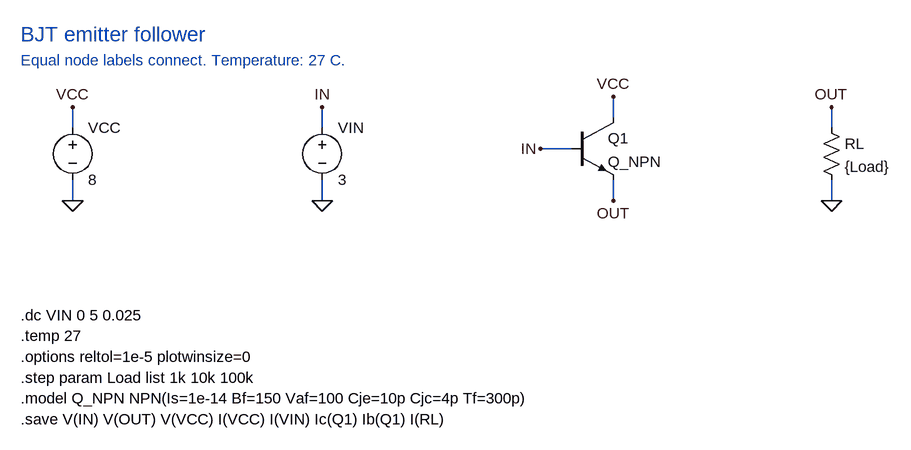
[diagram p0: schematic emitter-follower.asc]
emitter-follower.asc, the LTspice schematic file:
Version 4
SHEET 1 1740 776
WIRE 144 176 144 144
WIRE 144 256 144 288
WIRE 528 176 528 144
WIRE 528 256 528 288
WIRE 976 160 976 128
WIRE 912 208 864 208
WIRE 976 256 976 288
WIRE 1312 176 1312 144
WIRE 1312 256 1312 288
FLAG 144 144 VCC
FLAG 144 288 0
FLAG 528 144 IN
FLAG 528 288 0
FLAG 976 128 VCC
FLAG 864 208 IN
FLAG 976 288 OUT
FLAG 1312 144 OUT
FLAG 1312 288 0
SYMBOL voltage 144 160 R0
SYMATTR InstName VCC
SYMATTR Value 8
SYMBOL voltage 528 160 R0
SYMATTR InstName VIN
SYMATTR Value 3
SYMBOL npn 912 160 R0
SYMATTR InstName Q1
SYMATTR Value Q_NPN
SYMBOL res 1296 160 R0
SYMATTR InstName RL
SYMATTR Value {Load}
TEXT 64 32 Left 3 ;BJT emitter follower
TEXT 64 72 Left 2 ;Equal node labels connect. Temperature: 27 C.
TEXT 64 464 Left 2 !.dc VIN 0 5 0.025
TEXT 64 496 Left 2 !.temp 27
TEXT 64 528 Left 2 !.options reltol=1e-5 plotwinsize=0
TEXT 64 560 Left 2 !.step param Load list 1k 10k 100k
TEXT 64 592 Left 2 !.model Q_NPN NPN(Is=1e-14 Bf=150 Vaf=100 Cje=10p Cjc=4p Tf=300p)
TEXT 64 624 Left 2 !.save V(IN) V(OUT) V(VCC) I(VCC) I(VIN) Ic(Q1) Ib(Q1) I(RL)

The netlist it stands for:
* emitter-follower.asc
VCC VCC 0 8
VIN IN 0 3
Q1 VCC IN OUT 0 Q_NPN
RL OUT 0 {Load}
.model NPN NPN
.model PNP PNP
.lib standard.bjt
* BJT emitter follower
* Equal node labels connect. Temperature: 27 C.
.dc VIN 0 5 0.025
.temp 27
.options reltol=1e-5 plotwinsize=0
.step param Load list 1k 10k 100k
.model Q_NPN NPN(Is=1e-14 Bf=150 Vaf=100 Cje=10p Cjc=4p Tf=300p)
.save V(IN) V(OUT) V(VCC) I(VCC) I(VIN) Ic(Q1) Ib(Q1) I(RL)
.backanno
.end